# Altium schematic sheet AltiumDesigner - Sheet_1.schdoc
size 321 x 217 mm
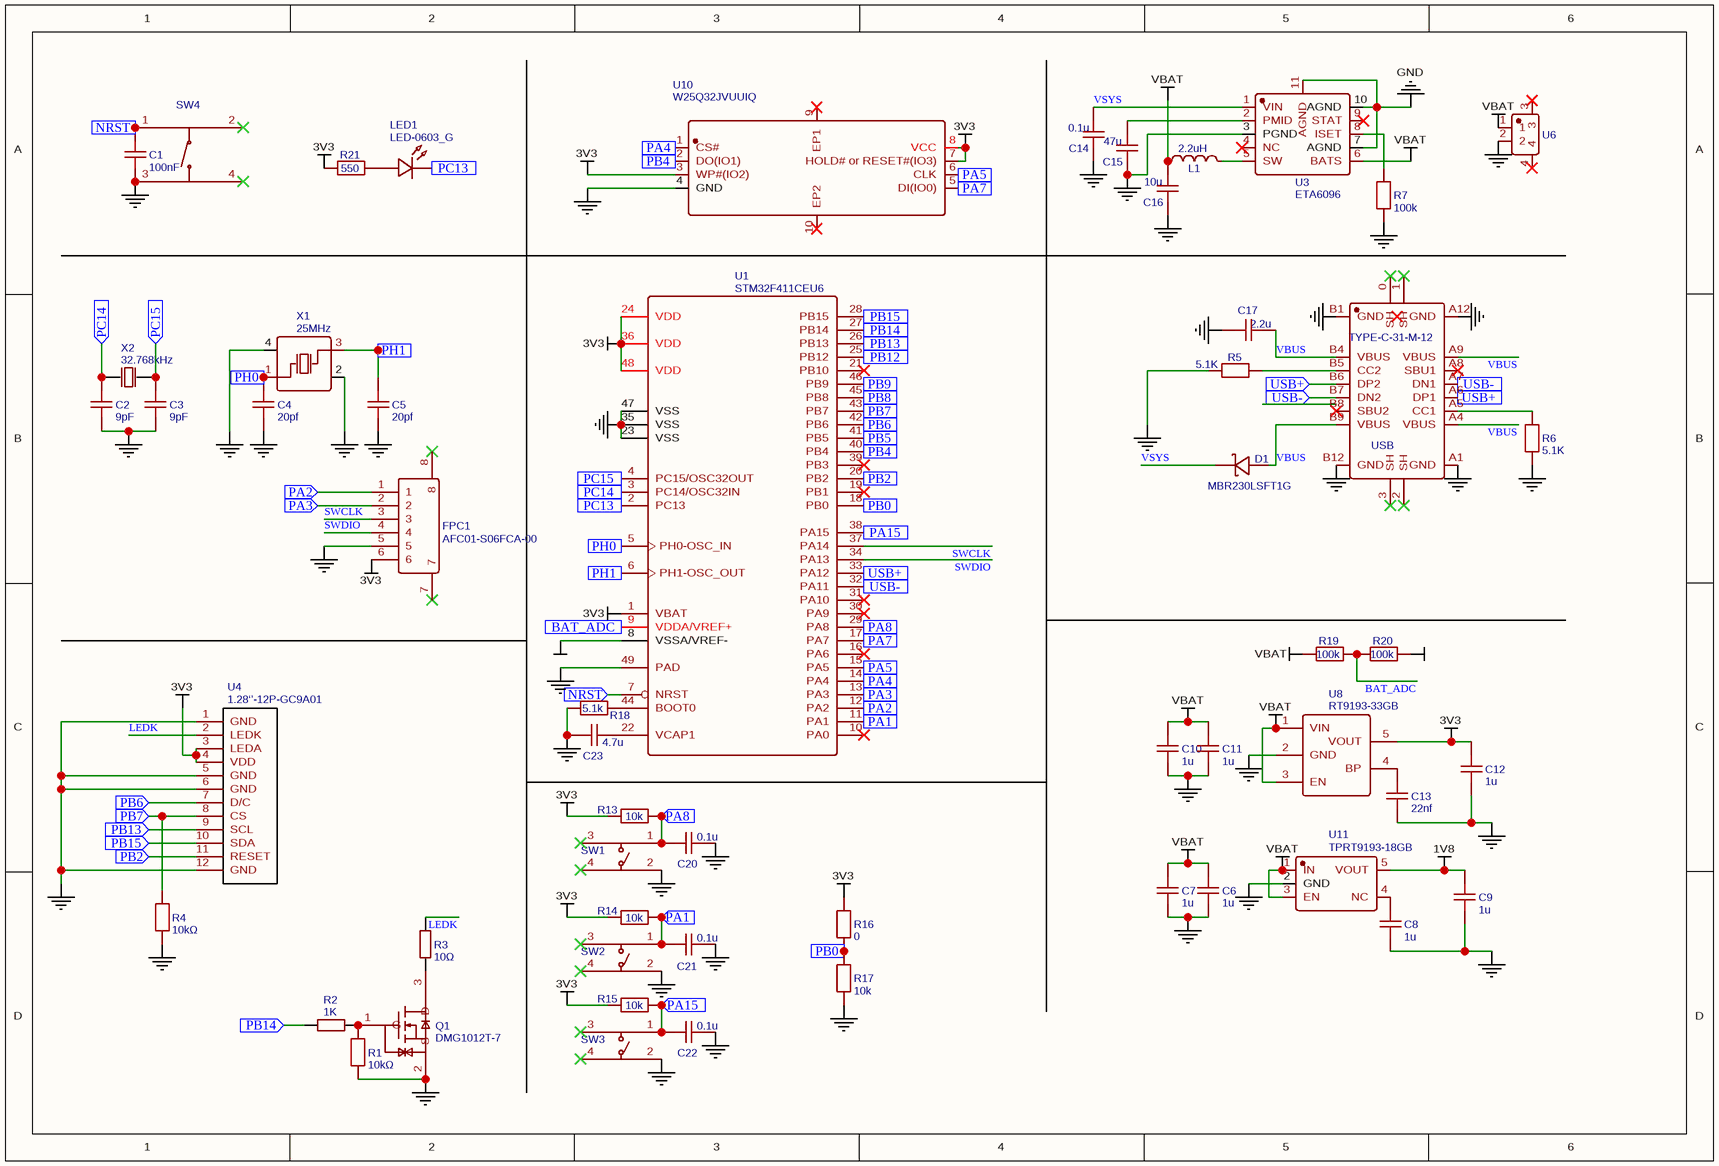
[diagram p0: AltiumDesigner - Sheet_1.schdoc]

## Parts
C1  100nF  [C0201]
C2  9pF  [C0201]
C3  9pF  [C0201]
C4  20pf  [C0201]
C5  20pf  [C0201]
C6  1u  [C0201]
C7  1u  [C0201]
C8  1u  [C0201]
C9  1u  [C0201]
C10  1u  [C0201]
C11  1u  [C0201]
C12  1u  [C0201]
C13  22nf  [C0201]
C14  0.1u  [C0201]
C15  47u  [C0805]
C16  10u  [C0805]
C17  2.2u  [C0201]
C20  0.1u  [C0201]
C21  0.1u  [C0201]
C22  0.1u  [C0201]
C23  4.7u  [C0201]
D1  MBR230LSFT1G  [SOD-123FL_L2.7-W1.8-LS3.8-RD]
FPC1  AFC01-S06FCA-00  [FPC-SMD_P0.50-6P_AFC01-S06FCA-00]
L1  2.2uH  [IND-SMD_L4.0-W4.0_VLCF4024-2]
LED1  LED-0603_G  [LED0603_GREEN]
Q1  DMG1012T-7  [SOT-523-3_L1.6-W0.8-P1.00-LS1.6-BR]
R1  10kΩ  [R0402]
R2  1K  [R0402]
R3  10Ω  [R0402]
R4  10kΩ  [R0402]
R5  5.1K  [R0201]
R6  5.1K  [R0201]
R7  100k  [R0201]
R13  10k  [R0201]
R14  10k  [R0201]
R15  10k  [R0201]
R16  0  [R0402]
R17  10k  [R0201]
R18  5.1k  [R0201]
R19  100k  [R0201]
R20  100k  [R0201]
R21  550  [R0402]
SW1  EVQPUD02K  [SW-SMD_EVQPUD02K-1]  (value not drawn)
SW2  EVQPUD02K  [SW-SMD_EVQPUD02K-1]  (value not drawn)
SW3  EVQPUD02K  [SW-SMD_EVQPUD02K-1]  (value not drawn)
SW4  PTS830GM140SMTRLFS  [KEY-SMD_4P-L3.0-W2.6-P1.80-LS3.5]  (value not drawn)
U1  STM32F411CEU6  [UFQFPN-48_L7.0-W7.0-P0.50-BL-EP]
U3  ETA6096  [TDFN-10_L3.0-W3.0-P0.50-BL-EP]
U4  1.28‘’-12P-GC9A01  [1.28‘’-12P-GC9A01]
U6  1.25MM*2P_W  [CONN-SMD_1.25MM-2P_W]  (value not drawn)
U8  RT9193-33GB  [SOT-23-5_L3.0-W1.7-P0.95-LS2.8-BL]
U10  W25Q32JVUUIQ  [USON-8_L4.0-W3.0-P0.80-BL_WINBOND_UU]
U11  TPRT9193-18GB  [SOT-23-5_L3.0-W1.7-P0.95-LS2.8-BL]
USB  TYPE-C-31-M-12  [USB-C_SMD-TYPE-C-31-M-12]
X1  25MHz  [OSC-SMD_4P-L3.2-W2.5-BL]
X2  32.768kHz  [OSC-SMD_L2.0-W1.2]

## Ports
BAT_ADC (in), NRST (in), PA1 (in), PA2 (in), PA3 (in), PA4 (in), PA5 (in), PA7 (in), PA8 (in), PA15 (in), PB0 (in), PB2 (in), PB4 (in), PB5 (in), PB6 (in), PB7 (in), PB8 (in), PB9 (in), PB12 (in), PB13 (in), PB14 (in), PB15 (in), PC13 (in), PC14 (in), PC15 (in), PH0 (in), PH1 (in), USB+ (in), USB- (in)

## Nets
1V8: C9.2 U11.5(VOUT)
3V3: C12.2 FPC1.6 R13.2 R14.2 R15.2 R16.2 R21.1 U1.1(VBAT) U1.24(VDD) U1.36(VDD) U1.48(VDD) U4.3(LEDA) U4.4(VDD) U8.5(VOUT) U10.3(WP#(IO2)) U10.7(HOLD#_or_RESET#(IO3)) U10.8(VCC)
GND: C1.1 C2.1 C3.1 C4.1 C5.1 C6.1 C7.1 C8.1 C9.1 C10.1 C11.1 C12.1 C13.2 C14.1 C15.1 C16.1 C17.1 C20.2 C21.2 C22.2 C23.1 FPC1.5 Q1.2(S) R1.1 R4.2 R5.1 R6.1 R7.1 R17.1 R18.1 R20.2 SW1.2 SW2.2 SW3.2 SW4.3 U1.8(VSSA/VREF-) U1.23(VSS) U1.35(VSS) U1.47(VSS) U1.49(PAD) U3.3(PGND) U3.7(AGND) U3.10(AGND) U3.11(AGND) U4.1(GND) U4.5(GND) U4.6(GND) U4.12(GND) U6.2 U8.2(GND) U10.4(GND) U11.2(GND) USB.A1(GND) USB.A12(GND) USB.B1(GND) USB.B12(GND) X1.2(GND) X1.4(GND)
VBAT: C6.2 C7.2 C10.2 C11.2 C16.2 L1.1 R19.1 U3.6(BATS) U6.1 U8.1(VIN) U8.3(EN) U11.1(IN) U11.3(EN)
BAT_ADC: U1.9(VDDA/VREF+) ; port BAT_ADC
BAT_ADC: R19.2 R20.1  [a separate net that carries the same name]
LEDK: R3.2 U4.2(LEDK)
NRST: C1.2 SW4.1 U1.7(NRST) ; port NRST
PA1: C21.1 R14.1 SW2.1 U1.11(PA1) ; port PA1
PA2: FPC1.1 U1.12(PA2) ; port PA2
PA3: FPC1.2 U1.13(PA3) ; port PA3
PA4: U1.14(PA4) U10.1(CS#) ; port PA4
PA5: U1.15(PA5) U10.6(CLK) ; port PA5
PA7: U1.17(PA7) U10.5(DI(IO0)) ; port PA7
PA8: C20.1 R13.1 SW1.1 U1.29(PA8) ; port PA8
PA15: C22.1 R15.1 SW3.1 U1.38(PA15) ; port PA15
PB0: R16.1 R17.2 U1.18(PB0) ; port PB0
PB2: U1.20(PB2) U4.11(RESET) ; port PB2
PB4: U1.40(PB4) U10.2(DO(IO1)) ; port PB4
PB5: U1.41(PB5) ; port PB5
PB6: U1.42(PB6) U4.7(D/C) ; port PB6
PB7: R4.1 U1.43(PB7) U4.8(CS) ; port PB7
PB8: U1.45(PB8) ; port PB8
PB9: U1.46(PB9) ; port PB9
PB12: U1.25(PB12) ; port PB12
PB13: U1.26(PB13) U4.9(SCL) ; port PB13
PB14: R2.1 U1.27(PB14) ; port PB14
PB15: U1.28(PB15) U4.10(SDA) ; port PB15
PC13: LED1.2 U1.2(PC13) ; port PC13
PC14: C2.2 U1.3(PC14/OSC32IN) X2.1(OSC1) ; port PC14
PC15: C3.2 U1.4(PC15/OSC32OUT) X2.2(OSC2) ; port PC15
PH0: C4.2 U1.5(PH0-OSC_IN) X1.1(OSC1) ; port PH0
PH1: C5.2 U1.6(PH1-OSC_OUT) X1.3(OSC2) ; port PH1
SWCLK: FPC1.3 U1.37(PA14)
SWDIO: FPC1.4 U1.34(PA13)
USB+: U1.33(PA12) USB.A6(DP1) USB.B6(DP2) ; port USB+
USB-: U1.32(PA11) USB.A7(DN1) USB.B7(DN2) ; port USB-
VBUS: C17.2 D1.2(A) USB.A4(VBUS) USB.A9(VBUS) USB.B4(VBUS) USB.B9(VBUS)
VSYS: C14.2 D1.1(C) U3.1(VIN)
NetC8_2: C8.2 U11.4(NC)
NetC13_1: C13.1 U8.4(BP)
NetC15_2: C15.2 U3.2(PMID)
NetC23_2: C23.2 U1.22(VCAP1)
NetL1_2: L1.2 U3.5(SW)
NetLED1_1: LED1.1 R21.2
NetQ1_1: Q1.1(G) R1.2 R2.2
NetQ1_3: Q1.3(D) R3.1
NetR5_2: R5.2 USB.B5(CC2)
NetR6_2: R6.2 USB.A5(CC1)
NetR7_2: R7.2 U3.8(ISET)
NetR18_2: R18.2 U1.44(BOOT0)

Not connected (* = marked no-connect by the designer): FPC1 7* 8*; SW1 3* 4*; SW2 3* 4*; SW3 3* 4*; SW4 2* 4*; U1 10(PA0)* 16(PA6)* 19(PB1)* 21(PB10)* 30(PA9)* 31(PA10)* 39(PB3)*; U3 4(NC)* 9(STAT)*; U6 3* 4*; U10 9(EP1)* 10(EP2)*; USB 0(SH)* 1(SH)* 2(SH)* 3(SH)* A8(SBU1)* B8(SBU2)*

## Library data of the parts
C1 = 100nF: BOM_Manufacturer: SAMSUNG(三星); BOM_Manufacturer Part: CL05B104KB54PNC; nameAlias: Capacitance; Contributor: LCSC; BOM_Supplier: LCSC; BOM_Supplier Part: C307331; BOM_JLCPCB Part Class: Basic Part; spicePre: C; spiceSymbolName: CL05B104KB54PNC
C2 C3 = 9pF: BOM_Manufacturer: muRata(村田); BOM_Manufacturer Part: GRM0335C1E9R0CA01D; nameAlias: Capacitance; Contributor: LCSC; BOM_Supplier: LCSC; BOM_Supplier Part: C237292; spicePre: C; spiceSymbolName: GRM0335C1E9R0CA01D
C4 C5 = 20pf: nameAlias: Value(F); Contributor: LCEDA_Lib; BOM_Supplier Part: C882568; spicePre: C; spiceSymbolName: C_0603_US
C6-C12 = 1u: nameAlias: Value(F); Contributor: LCEDA_Lib; spicePre: C; spiceSymbolName: C_0603_US
C13 = 22nf: nameAlias: Value(F); Contributor: LCEDA_Lib; spicePre: C; spiceSymbolName: C_0603_US
C14 C20-C22 = 0.1u: nameAlias: Value(F); Contributor: LCEDA_Lib; spicePre: C; spiceSymbolName: C_0201_US
C15 = 47u: nameAlias: Value(F); Contributor: LCEDA_Lib; spicePre: C; spiceSymbolName: C_0201_US
C16 = 10u: nameAlias: Value(F); Contributor: LCEDA_Lib; spicePre: C; spiceSymbolName: C_0201_US
C17 = 2.2u: nameAlias: Value(F); Contributor: LCEDA_Lib; spicePre: C; spiceSymbolName: C_0201_US
C23 = 4.7u: nameAlias: Value(F); Contributor: LCEDA_Lib; spicePre: C; spiceSymbolName: C_0201_US
D1 = MBR230LSFT1G: BOM_Manufacturer: onsemi(安森美); Contributor: LCSC; BOM_Supplier: LCSC; BOM_Manufacturer Part: MBR230LSFT1G; BOM_Supplier Part: C126673; BOM_JLCPCB Part Class: Extended Part; spicePre: D; spiceSymbolName: MBR230LSFT1G
FPC1 = AFC01-S06FCA-00: BOM_Manufacturer: JS(钜硕电子); Contributor: LCSC; BOM_Supplier: LCSC; BOM_Supplier Part: C262655; BOM_Manufacturer Part: AFC01-S06FCA-00; BOM_JLCPCB Part Class: Extended Part; spicePre: F; spiceSymbolName: AFC01-S06FCA-00
L1 = 2.2uH: BOM_Manufacturer: TDK; BOM_Manufacturer Part: VLCF4024T-2R2N1R7-2; nameAlias: Inductance; BOM_Supplier: LCSC; BOM_Supplier Part: C89447; BOM_JLCPCB Part Class: Extended Part; spicePre: L; spiceSymbolName: VLCF4024T-2R2N1R7-2
LED1 = LED-0603_G: BOM_Manufacturer: EVERLIGHT(台湾亿光); BOM_Manufacturer Part: 19-217/GHC-YR1S2/3T; Contributor: LCEDA_Lib; BOM_Supplier Part: C72043; BOM_Supplier: LCSC; spicePre: L; spiceSymbolName: LED-0603_G
Q1 = DMG1012T-7: BOM_Manufacturer: DIODES(美台); Contributor: LCSC; BOM_Supplier: LCSC; BOM_Manufacturer Part: DMG1012T-7; BOM_Supplier Part: C20512; BOM_JLCPCB Part Class: Extended Part; spicePre: Q; spiceSymbolName: DMG1012T-7
R1 R4 = 10kΩ: BOM_Manufacturer: UNI-ROYAL(厚声); BOM_Manufacturer Part: TC0325D1002T5F; Contributor: lcsc; nameAlias: Resistance; BOM_Supplier: LCSC; BOM_Supplier Part: C2989345; link: https://atta.szlcsc.com/upload/public/pdf/source/20220708/6ACD1707201702E70C0F417A19EB926E.pdf; spicePre: U; spiceSymbolName: TC0325D1002T5F
R2 = 1K: BOM_Manufacturer: YAGEO(国巨); BOM_Manufacturer Part: RT0603BRD071KL; nameAlias: Resistance (Ohms); Resistance: 1kΩ; BOM_Supplier: LCSC; BOM_Supplier Part: C110776; BOM_JLCPCB Part Class: Extended Part; spicePre: R; spiceSymbolName: RT0603BRD071KL
R3 = 10Ω: BOM_Manufacturer: RALEC(旺诠); BOM_Manufacturer Part: RTT05100JTP; nameAlias: Resistance; Resistance (Ohms): 10; BOM_Supplier: LCSC; BOM_Supplier Part: C103908; BOM_JLCPCB Part Class: Extended Part; spicePre: R; spiceSymbolName: RTT05100JTP
R5 R6 = 5.1K: nameAlias: Value(Ω); Contributor: LCEDA_Lib; spicePre: R; spiceSymbolName: R_0603_EU
R7 R19 R20 = 100k: nameAlias: Value(Ω); Contributor: LCEDA_Lib; spicePre: R; spiceSymbolName: R_0201_EU
R13-R15 R17 = 10k: nameAlias: Value(Ω); Contributor: LCEDA_Lib; spicePre: R; spiceSymbolName: R_0201_EU
R16 = 0: nameAlias: Value(Ω); Contributor: LCEDA_Lib; spicePre: R; spiceSymbolName: R_0402_EU
R18 = 5.1k: nameAlias: Value(Ω); Contributor: LCEDA_Lib; spicePre: R; spiceSymbolName: R_0201_EU
R21 = 550: nameAlias: Value(Ω); Contributor: LCEDA_Lib; spicePre: R; spiceSymbolName: R_0402_EU
SW1-SW3 = EVQPUD02K: BOM_Manufacturer: PANASONIC(松下); Contributor: LCSC; BOM_Supplier: LCSC; BOM_Supplier Part: C388885; BOM_Manufacturer Part: EVQPUD02K; BOM_JLCPCB Part Class: Extended Part; spicePre: S; spiceSymbolName: EVQPUD02K
SW4 = PTS830GM140SMTRLFS: BOM_Manufacturer: C&K; Contributor: LCSC; BOM_Supplier: LCSC; BOM_Supplier Part: C221904; BOM_Manufacturer Part: PTS830GM140SMTRLFS; BOM_JLCPCB Part Class: Extended Part; spicePre: S; spiceSymbolName: PTS830GM140SMTRLFS
U1 = STM32F411CEU6: BOM_Manufacturer: ST(意法半导体); BOM_Supplier: LCSC; BOM_Manufacturer Part: STM32F411CEU6; BOM_Supplier Part: C60420; BOM_JLCPCB Part Class: Extended Part; spicePre: U; spiceSymbolName: STM32F411CEU6
U3 = ETA6096: BOM_Manufacturer: null; Contributor: lcsc; BOM_Supplier: LCSC; BOM_Supplier Part: C9900033047; BOM_Manufacturer Part: ETA6096; link: https://atta.szlcsc.comnull; spicePre: U; spiceSymbolName: ETA6096
U4 = 1.28‘’-12P-GC9A01: Contributor: JC_chan7; spicePre: U; spiceSymbolName: 1.28‘’-12P-GC9A01
U6 = 1.25MM*2P_W: BOM_Manufacturer: null; Contributor: LCSC; BOM_Supplier: LCSC; BOM_Supplier Part: C2941239; BOM_Manufacturer Part: 1.25mm*2P_W; BOM_JLCPCB Part Class: Extended Part; spicePre: U; spiceSymbolName: 1.25MM*2P_W
U8 = RT9193-33GB: BOM_Manufacturer: RICHTEK(立锜); BOM_Supplier: LCSC; BOM_Manufacturer Part: RT9193-33GB; BOM_Supplier Part: C15651; BOM_JLCPCB Part Class: Extended Part; spicePre: U; spiceSymbolName: RT9193-33GB
U10 = W25Q32JVUUIQ: BOM_Manufacturer: WINBOND(华邦); Contributor: lcsc; BOM_Supplier: LCSC; BOM_Supplier Part: C2999380; BOM_Manufacturer Part: W25Q32JVUUIQ; link: https://atta.szlcsc.com/upload/public/pdf/source/20220419/71F2D20BDA1217995CECC027DED216BE.pdf; BOM_JLCPCB Part Class: Extended Part; spicePre: U; spiceSymbolName: W25Q32JVUUIQ
U11 = TPRT9193-18GB: BOM_Manufacturer: TECH PUBLIC(台舟); Contributor: LCSC; BOM_Supplier: LCSC; BOM_Supplier Part: C2835438; BOM_Manufacturer Part: TPRT9193-18GB; BOM_JLCPCB Part Class: Extended Part; spicePre: U; spiceSymbolName: TPRT9193-18GB
USB = TYPE-C-31-M-12: BOM_Manufacturer: 韩国韩荣; Contributor: LCSC; BOM_Supplier: LCSC; BOM_Supplier Part: C165948; BOM_Manufacturer Part: TYPE-C-31-M-12; BOM_JLCPCB Part Class: Extended Part; spicePre: U; spiceSymbolName: TYPE-C-31-M-12
X1 = 25MHz: BOM_Manufacturer: TAE(雅晶鑫); BOM_Manufacturer Part: TAXM25M4RLBCCT2T; nameAlias: Frequency; Contributor: LCSC; BOM_Supplier: LCSC; BOM_Supplier Part: C164045; BOM_JLCPCB Part Class: Extended Part; spicePre: X; spiceSymbolName: SMD-3225_4P25MHZ20PF10PPM-40~+85℃
X2 = 32.768kHz: BOM_Manufacturer: EPSON(爱普生); BOM_Manufacturer Part: FC-12M32.768KHZ9PF20PPM; Contributor: LCSC; nameAlias: Frequency; BOM_Supplier: LCSC; BOM_Supplier Part: C96341; BOM_JLCPCB Part Class: Extended Part; spicePre: X; spiceSymbolName: FC-12M32.768KHZ9PF20PPM